# EAGLE design invader_coin2 (EAGLE 7.5.0)
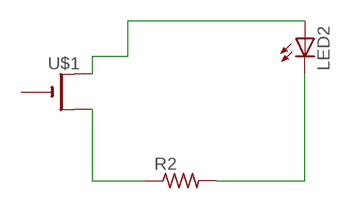
[diagram p0: schematic, sheet 1]

## Parts
LED2  LED5MM  [LED5MM]
R2  R-US_0309/12  [0309/12]
U$1  CR2032THM  [CR2032-THRU]

## Nets
N$1: LED2.A U$1.+1(+)
N$2: R2.1 U$1.+2(+1)
N$3: LED2.K(C) R2.2
Unconnected: U$1.-

## Library data of the parts
LED2 = adafruit:LED: LED OSRAM: - CHIPLED LG R971, LG N971, LY N971, LG Q971, LY Q971, LO R971, LY R971 LH N974, LH R974 LS Q976, LO Q976, LY Q976 LO Q996 - Hyper CHIPLED LW Q18S LB Q993, LB Q99A, LB R99A - SideLED LS A670, LO A670, LY A670, LG A670, LP A670 LB A673, LV A673, LT A673, LW A673 LH A674 LY A675 LS A676, LA A676, LO A676, LY A676, LW A676 LS A679, LY A679, LG A679 - Hyper Micro SIDELED® LS Y876, LA Y876, LO Y876, LY Y876 LT Y87S - SmartLED LW L88C, LW L88S LB L89C, LB L89S, LG L890 LS L89K, LO L89K, LY L89K LS L896, LA L896, LO L896, LY L896 - TOPLED LS T670, LO T670, LY T670, LG T670, LP T670 LSG T670, LSP T670, LSY T670, LOP T670, LYG T670 LG T671, LOG T671, LSG T671 LB T673, LV T673, LT T673, LW T673 LH T674 LS T676, LA T676, LO T676, LY T676, LB T676, LH T676, LSB T676, LW T676 LB T67C, LV T67C, LT T67C, LS T67K, LO T67K, LY T67K, LW E67C LS E67B, LA E67B, LO E67B, LY E67B, LB E67C, LV E67C, LT E67C LW T67C LS T679, LY T679, LG T679 LS T770, LO T770, LY T770, LG T770, LP T770 LB T773, LV T773, LT T773, LW T773 LH T774 LS E675, LA E675, LY E675, LS T675 LS T776, LA T776, LO T776, LY T776, LB T776 LHGB T686 LT T68C, LB T68C - Hyper Mini TOPLED® LB M676 - Mini TOPLED Santana® LG M470 LS M47K, LO M47K, LY M47K Source: http://www.osram.convergy.de/
R2 = adafruit:R-US_: RESISTOR, American symbol
U$1 = adafruit:CR2032

## Board
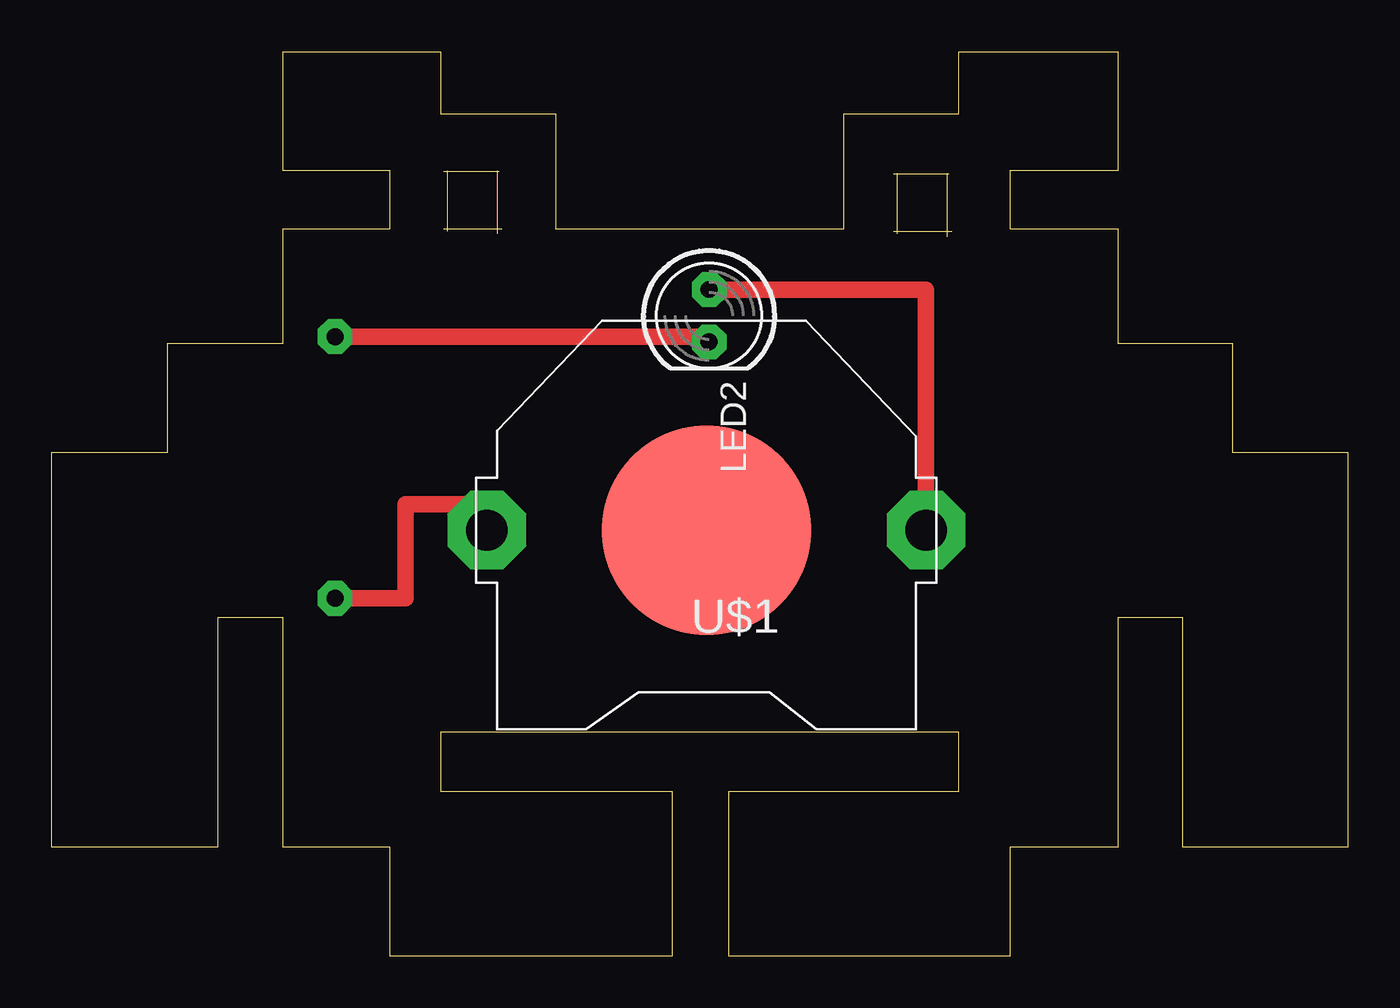
[diagram p1: board, top side]
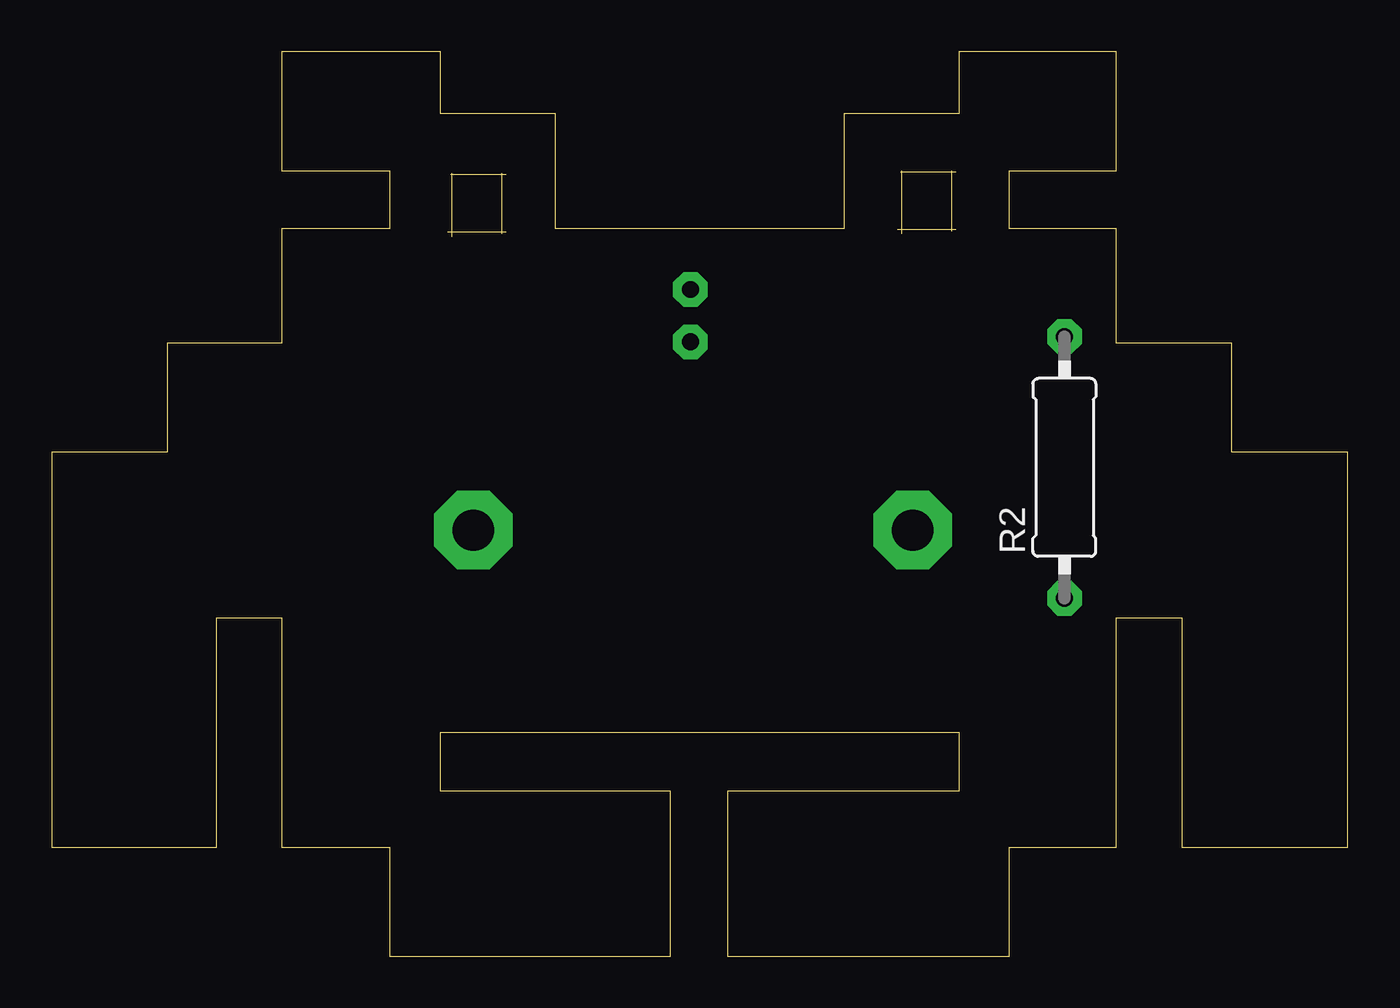
[diagram p2: board, bottom side, seen from below]

Size 62.96 x 43.91 mm. Coordinates in mm from the lower left corner, seen from the top.
Outline: 41.08,35.05 41.08,38
Outline: 43.5,34.92 43.5,38
Outline: 43.71,35.16 40.89,35.16
Outline: 43.59,37.95 40.89,37.95
Outline: 19.24,35.18 19.24,38.13
Outline: 21.65,35.05 21.65,38.13
Outline: 21.87,35.28 19.04,35.28
Outline: 21.74,38.08 19.04,38.08
Outline: 16.45,5.27 11.24,5.27 11.24,16.41 8.06,16.41 8.06,5.27 0,5.27 0,24.45 5.65,24.45 5.65,29.75 11.24,29.75 11.24,35.31 16.45,35.31 16.45,38.13 11.24,38.13 11.24,43.91 18.89,43.91 18.89,40.89 24.48,40.89 24.48,35.31 38.48,35.31 38.48,40.89 44.07,40.89 44.07,43.91 51.78,43.91 51.78,38.13 46.55,38.13 46.55,35.31 51.78,35.31 51.78,29.75 57.34,29.75 57.34,24.45 62.96,24.45 62.96,5.27 54.93,5.27 54.93,16.41 51.78,16.41 51.78,5.27 46.55,5.27 46.55,0 32.89,0 32.89,8 44.07,8 44.07,10.86 18.89,10.86 18.89,8 30.13,8 30.13,0 16.45,0 16.45,5.27
Copper layers (1*16): Top 0.035mm / dielectric 1.5mm / Bottom 0.035mm
Design rules "default": minimum track width 10mil, minimum drill 24mil, track to track 8mil, track to pad 8mil, pad to pad 8mil, via to via 8mil, smd to smd 8mil, copper to edge 40mil, drill to drill 8mil, minimum pad ring 10mil, minimum via ring 8mil, stop-mask expansion 4mil, vias tented up to drill 0mil, thermal gap 10mil

### Footprints (pad centres in the part's own frame; a part is rotated, then mirrored left to right if it is on the bottom)
LED5MM = drill 0.813 pad 1.676 octagon: A -1.27,0; K 1.27,0
0309/12 = drill 0.813 pad 1.676 octagon: 1 -6.35,0; 2 6.35,0
CR2032-THRU = drill 2 pad 3.81 octagon: +1 -10.668,0; +2 10.668,0 | smd 10.16 x 10.16: - 0,0

### Placement (x,y rotation side)
LED2  31.93,31.08 270 top
R2  13.77,23.72 90 bottom
U$1  31.81,20.67 180 top

### Tracks (layer width: path | path; a pad name or v marks a point on that pad's centre or on a via)
N$1
  Top 0.813: LED2.A 42.47,32.35 U$1.+1
N$2
  Top 0.813: R2.1 17.2,17.37 17.2,21.94 20.88,21.94 U$1.+2
N$3
  Top 0.813: R2.2 31.93,30.07 LED2.K